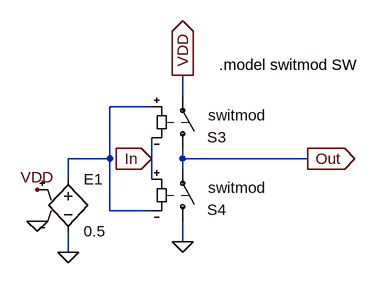
[diagram p0: schematic inverter.asc]
inverter.asc, the LTspice schematic file:
Version 4
SHEET 1 6308 700
WIRE 1920 -272 1920 -304
WIRE 1872 -256 1808 -256
WIRE 1808 -176 1808 -256
WIRE 1808 -176 1744 -176
WIRE 1872 -176 1872 -208
WIRE 1920 -176 1920 -192
WIRE 2112 -176 1920 -176
WIRE 1920 -160 1920 -176
WIRE 1744 -144 1744 -176
WIRE 1872 -144 1872 -176
WIRE 1808 -96 1808 -176
WIRE 1872 -96 1808 -96
WIRE 1920 -48 1920 -80
WIRE 1744 -32 1744 -64
FLAG 1872 -176 In
IOPIN 1872 -176 In
FLAG 1920 -304 VDD
IOPIN 1920 -304 Out
FLAG 1920 -48 0
FLAG 2112 -176 Out
IOPIN 2112 -176 Out
FLAG 1744 -32 0
FLAG 1696 -80 0
FLAG 1696 -128 VDD
SYMBOL sw 1920 -176 M180
WINDOW 3 24 -12 Left 0
WINDOW 38 39 67 Left 0
WINDOW 0 38 33 Left 0
SYMATTR Value ""
SYMATTR SpiceModel switmod
SYMATTR InstName S3
SYMBOL sw 1920 -64 M180
WINDOW 3 24 -12 Left 0
WINDOW 38 39 67 Left 0
WINDOW 0 38 33 Left 0
SYMATTR Value ""
SYMATTR SpiceModel switmod
SYMATTR InstName S4
SYMBOL e 1744 -160 R0
SYMATTR InstName E1
SYMATTR Value 0.5
TEXT 1976 -320 Left 0 !.model switmod SW

The netlist it stands for:
* inverter.asc
S3 Out VDD N001 In switmod
S4 0 Out In N001 switmod
E1 N001 0 VDD 0 0.5
.model switmod SW
.backanno
.end